# Altium schematic sheet Temp_Sensors.SchDoc: One Wire Devices
size A4; DrawnBy: Michael Watzek; Organization: HTL Hollabrunn; Address1: Abteilung Elektronik; Address2: Anton Ehrenfried-Straße 10; Address3: 2020 Hollabrunn; DocumentNumber: 10; Revision: 01; SheetNumber: 10; SheetTotal: 12
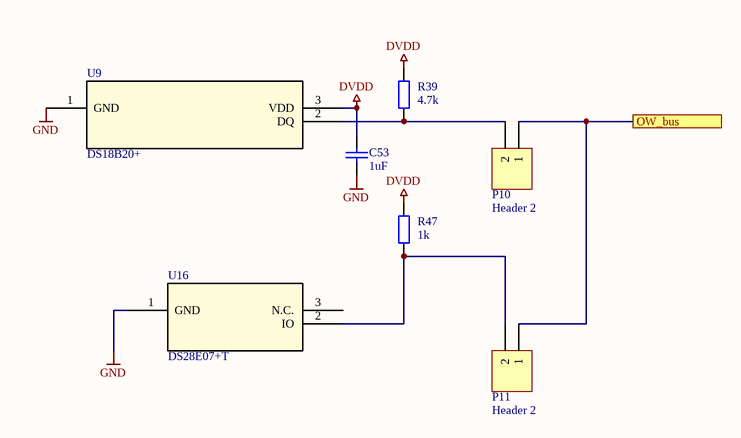
[diagram p0: Temp_Sensors.SchDoc]

## Parts
C53  1uF  [C1206-KUE]
P10  Header 2  [HDR1X2]
P11  Header 2  [HDR1X2]
R39  4.7k  [C1206-KUE]
R47  1k  [C1206-KUE]
U9  DS18B20+  [21-0248A_Q3-1_MXM]
U16  DS28E07+T  [21-0250_Q3+4_MXM]

## Ports
OW_bus

## Nets
DVDD: C53.2 R39.1 R47.1 U9.3(VDD)
GND: C53.1 U9.1(GND) U16.1(GND)
OW_bus: P10.1 P11.1 ; port OW_bus
NetP10_2: P10.2 R39.2 U9.2(DQ)
NetP11_2: P11.2 R47.2 U16.2(IO)

Not connected (* = marked no-connect by the designer): U16 3(N.C.)

## Notes on the sheet
- Title
- Size:
- Date:
- A4
- Number:
- Time:
- Revision:
- Sheet
- of
- HTL Hollabrunn
- Abteilung Elektronik
- Anton Ehrenfried-Straße 10
- 2020 Hollabrunn
- File:
- Drawn By:

## Library data of the parts
C53 = Capacitor: Manufacturer: Kemet; Bezeichnung: Kerko +-10% 63V; Published: 8-Jun-2000; LatestRevisionDate: 17-Jul-2002; LatestRevisionNote: Re-released for DXP Platform.; PackageReference: RAD-0.3; Publisher: Altium Limited; PackageDescription: Radial Cap, Thru-Hole; 2 Leads; 0.3 in Pin Spacing; Value: 1uF; Orderingcode: *
P10 P11 = Header 2: Header, 2-Pin; LatestRevisionDate: 17-Jul-2002; LatestRevisionNote: Re-released for DXP Platform.; Publisher: Altium Limited
R39 R47 = ResistorSMD: Resistor SMD; Manufacturer: AVX; Bezeichnung: SMD Wid. 1/8W 2%; Published: 8-Jun-2000; LatestRevisionDate: 17-Jul-2002; LatestRevisionNote: Re-released for DXP Platform.; PackageReference: AXIAL-0.4; Publisher: Altium Limited; PackageDescription: Axial Device, Thru-Hole; 2 Leads; 0.4 in Pin Spacing; Orderingcode: *
  R39: Value: 4.7k
  R47: Value: 1k
U9 = DS18B20+: Programmable Resolution 1-Wire Digital Thermometer; Manufacturer_Name: Analog Devices Inc; Copyright: Copyright (C) 2025 Ultra Librarian. All rights reserved.; Manufacturer_Part_Number: DS18B20+; RefDes: RefDes; Type: Type
U16 = DS28E07+T: 1024-Bit, 1-Wire EEPROM; Manufacturer_Name: Analog Devices Inc; Copyright: Copyright (C) 2026 Ultra Librarian. All rights reserved.; Manufacturer_Part_Number: DS28E07+T; RefDes: RefDes; Type: Type